# EAGLE schematic display (EAGLE 9.6.2)
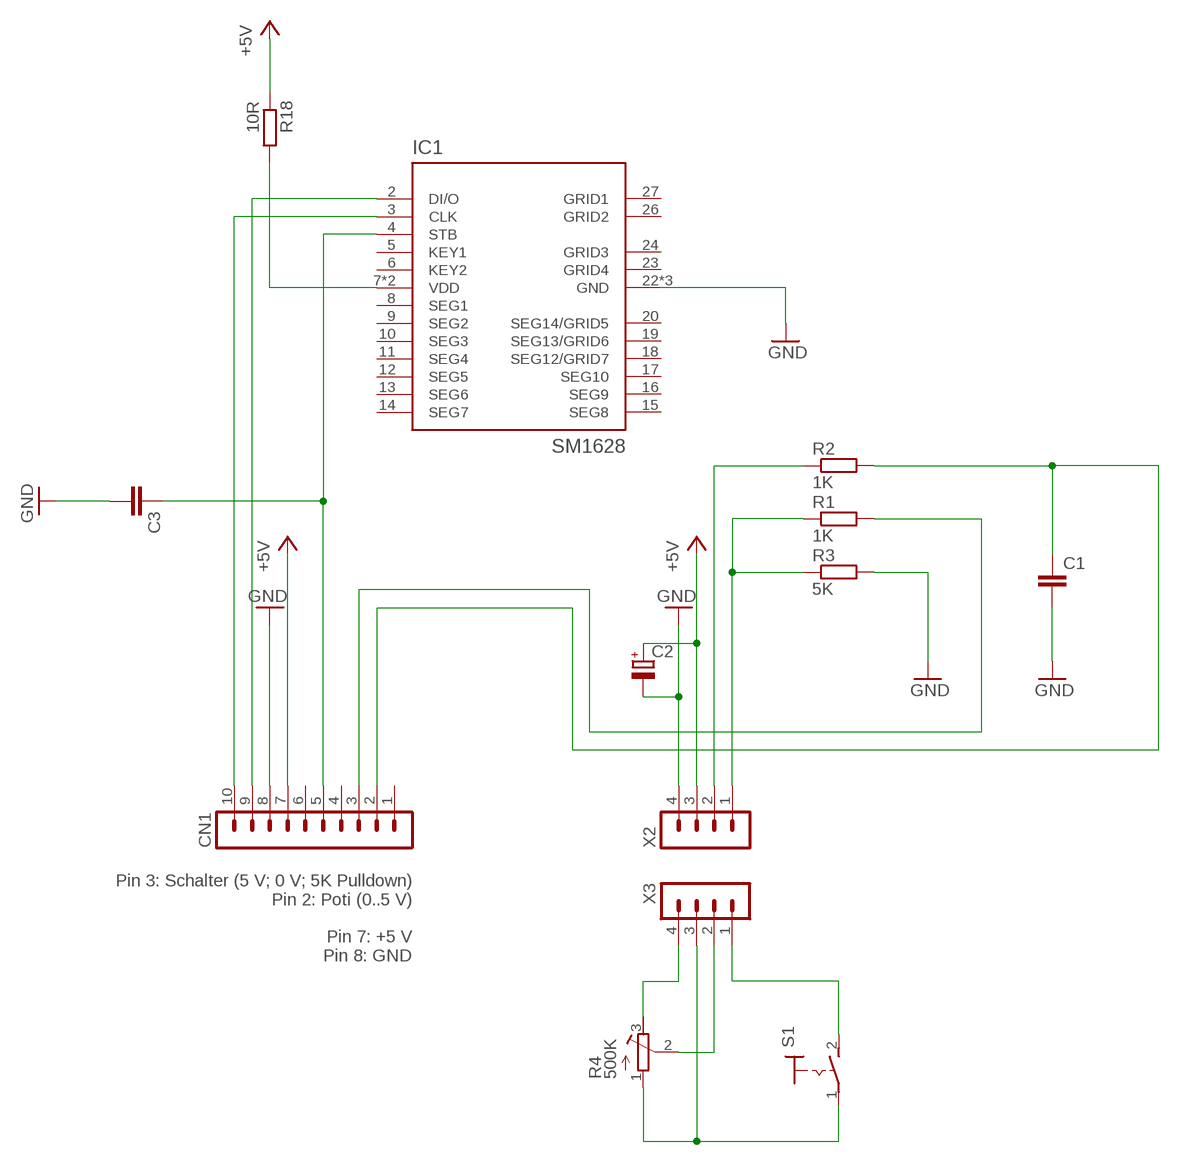
[diagram p0: schematic, sheet 1]

## Parts
C1  C-EU050-024X044  [C050-024X044]
C2  CPOL-EUE2-5  [E2-5]
C3  C-EU050-024X044  [C050-024X044]
CN1  MA10-1  [MA10-1]
IC1  SM1628  [SOP28]
R1  1K  R-EU_0207/10  [0207/10]
R2  1K  R-EU_0207/10  [0207/10]
R3  5K  R-EU_0207/10  [0207/10]
R4  500K  R-TRIMM3339P  [RTRIM3339P]
R18  10R  R-EU_0207/10  [0207/10]
S1  MS243  [MS243]
X2  MA04-1  [MA04-1]
X3  MA04-1  [MA04-1]

## Nets
+5V: C2.+ CN1.7 R18.1 X2.3
GND: C1.2 C2.- C3.2 CN1.8 IC1.22(GND) IC1.25(GND) IC1.28(GND) R3.2 X2.4
N$1: IC1.7(VDD) IC1.21(VDD) R18.2
N$2: R1.1 R3.1 X2.1
N$3: R2.1 X2.2
N$4: C1.1 CN1.2 R2.2
N$5: CN1.10 IC1.3(CLK)
N$6: CN1.3 R1.2
N$7: CN1.9 IC1.2(DI/O)
N$8: C3.1 CN1.5 IC1.4(STB)
N$9: R4.2(S) X3.2
N$10: R4.3(E) X3.4
N$11: R4.1(A) S1.1(P) X3.3
N$12: S1.2(S) X3.1
Unconnected: CN1.1 CN1.4 CN1.6 IC1.5(KEY1) IC1.6(KEY2) IC1.8(SEG1) IC1.9(SEG2) IC1.10(SEG3) IC1.11(SEG4) IC1.12(SEG5) IC1.13(SEG6) IC1.14(SEG7) IC1.15(SEG8) IC1.16(SEG9) IC1.17(SEG10) IC1.18(SEG12/GRID7) IC1.19(SEG13/GRID6) IC1.20(SEG14/GRID5) IC1.23(GRID4) IC1.24(GRID3) IC1.26(GRID2) IC1.27(GRID1)

## Notes on the sheet
- Pin 3: Schalter (5 V; 0 V; 5K Pulldown)
  Pin 2: Poti (0..5 V)
  
  Pin 7: +5 V
  Pin 8: GND

## Library data of the parts
C1 C3 = rcl:C-EU: CAPACITOR, European symbol; SPICEPREFIX: C
C2 = rcl:CPOL-EU: POLARIZED CAPACITOR, European symbol; SPICEPREFIX: C
CN1 = con-lstb:MA10-1: PIN HEADER; OC_FARNELL: unknown; OC_NEWARK: unknown
IC1 = SM1628:SM1628
R1-R3 R18 = rcl:R-EU_: RESISTOR, European symbol; SPICEPREFIX: R
R4 = rcl:R-TRIMM: Trimm resistor; SPICEMODEL: X; SPICEPREFIXL: POT
S1 = switch:MS243: TOGGLE SWITCH
X2 X3 = con-lstb:MA04-1: PIN HEADER; OC_FARNELL: unknown; OC_NEWARK: unknown